# EAGLE design BAROMETRO (EAGLE 9.5.1)
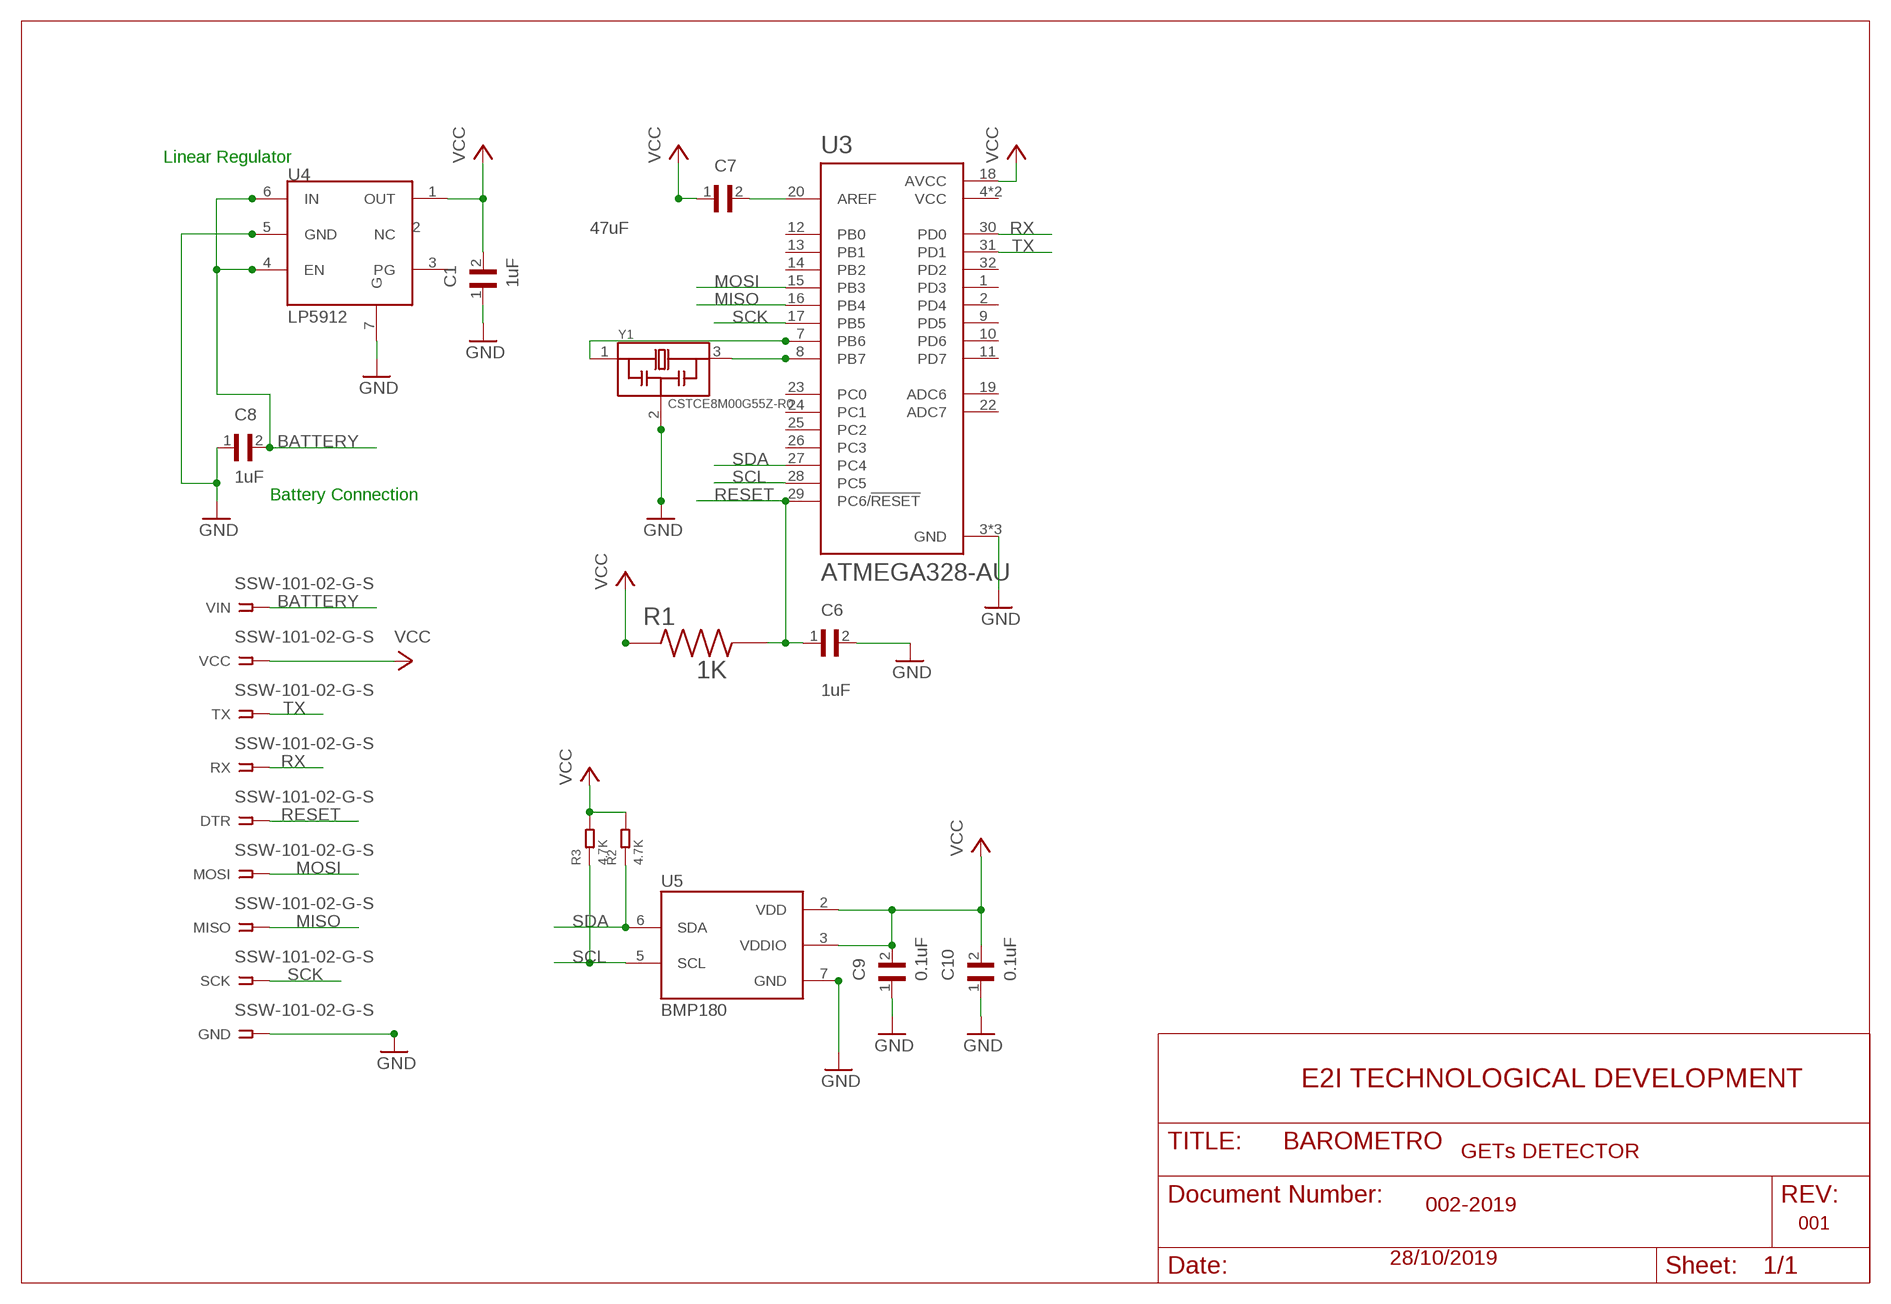
[diagram p0: schematic, sheet 1]

## Parts
C1  1uF  0402YD105MAT2A  [CAPC1005X71N]
C6  1uF  C1206C104K5RAC7025  [CAPC3216X88N]
C7  47uF  GRM32ED70J476ME20L  [CAPC3225X270N]
C8  1uF  0402YD105MAT2A  [CAPC1005X71N]
C9  0.1uF  C0805C104K1RECAUTO  [CAPC2012X110N]
C10  0.1uF  C0805C104K1RECAUTO  [CAPC2012X110N]
DTR  SSW-101-02-G-S  [SSW-101-02-G-S]
GND  SSW-101-02-G-S  [SSW-101-02-G-S]
MISO  SSW-101-02-G-S  [SSW-101-02-G-S]
MOSI  SSW-101-02-G-S  [SSW-101-02-G-S]
R1  1K  RNCS0805BKE1K00  [RESC2012X65N]
R2  4.7K  SMD-RES-4.7K-5%-1/16W(0402)  [R0402]
R3  4.7K  SMD-RES-4.7K-5%-1/16W(0402)  [R0402]
RX  SSW-101-02-G-S  [SSW-101-02-G-S]
SCK  SSW-101-02-G-S  [SSW-101-02-G-S]
TX  SSW-101-02-G-S  [SSW-101-02-G-S]
U3  ATMEGA328-AU  [QFP80P900X900X120-32N]
U4  LP5912  [LP5912]
U5  BMP180  [BMP180]
VCC  SSW-101-02-G-S  [SSW-101-02-G-S]
VIN  SSW-101-02-G-S  [SSW-101-02-G-S]
Y1  CSTCE8M00G55Z-R0  CSTCE16M0V53-R0  [OSC_CSTCE16M0V53-R0]

## Nets
BATTERY: C8.2 U4.4(EN) U4.6(IN) VIN.1
GND: C1.1 C6.2 C8.1 C9.1 C10.1 GND.1 U3.3(GND) U3.5(GND) U3.21(GND) U4.5(GND) U4.7(G) U5.7(GND) Y1.2
MISO: MISO.1 U3.16(PB4)
MOSI: MOSI.1 U3.15(PB3)
N$1: U3.7(PB6) Y1.1
N$2: U3.8(PB7) Y1.3
N$11: C7.2 U3.20(AREF)
RESET: C6.1 DTR.1 R1.2 U3.29(PC6/!RESET)
RX: RX.1 U3.30(PD0)
SCK: SCK.1 U3.17(PB5)
SCL: R3.1 U3.28(PC5) U5.5(SCL)
SDA: R2.1 U3.27(PC4) U5.6(SDA)
TX: TX.1 U3.31(PD1)
VCC: C1.2 C7.1 C9.2 C10.2 R1.1 R2.2 R3.2 U3.18(AVCC) U4.1(OUT) U5.2(VDD) U5.3(VDDIO) VCC.1
Unconnected: U3.1(PD3) U3.2(PD4) U3.9(PD5) U3.10(PD6) U3.11(PD7) U3.12(PB0) U3.13(PB1) U3.14(PB2) U3.19(ADC6) U3.22(ADC7) U3.23(PC0) U3.24(PC1) U3.25(PC2) U3.26(PC3) U3.32(PD2) U4.2(NC) U4.3(PG)

## Notes on the sheet
- Linear Regulator
- Battery Connection
- E2I TECHNOLOGICAL DEVELOPMENT
- GETs DETECTOR
- 002-2019
- 001
- 28/10/2019

## Power pins joined to a net without a drawn wire
VCC: U3.4(VCC) U3.6(VCC)

## Library data of the parts
C1 C8 = Capacitor1uF:0402YD105MAT2A: CAP 1UF 16VDC X5R 20% SMD 0402; AVAILABILITY: Unavailable; DESCRIPTION: Cap 1uf 16vdc X5r 20% Smd 0402; MF: AVX; MP: 0402YD105MAT2A; PACKAGE: 1005 AVX; PRICE: None
C6 = Cap Ceramic 0.1uF smd:C1206C104K5RAC7025; AVAILABILITY: Unavailable; DESCRIPTION: Cap Ceramic 0.1uF 50V X7R 10% SMD 1206 125C Plastic T/R; MF: KEMET; MP: C1206C104K5RAC7025; PACKAGE: 3216 KEMET; PRICE: None
C7 = capacitor 47uF smd:GRM32ED70J476ME20L: CAP 47UF 6.3VDC X7T 20% SMD 1210 EMBOSSED TAPE; AVAILABILITY: Unavailable; DESCRIPTION: Cap 47uf 6.3vdc X7t 20% Smd 1210 Embossed Tape; MF: Murata; MP: GRM32ED70J476ME20L; PACKAGE: 1210 Murata; PRICE: None
C9 C10 = Capacitor smd 104K1-RECAUTO:C0805C104K1RECAUTO: Cap Ceramic 0.1uF 100V X7R 10% Pad SMD 0805 125C T/R; AVAILABILITY: Unavailable; DESCRIPTION: Capacitor: ceramic; MLCC; 100nF; 100V; X7R; ±10%; SMD; 0805; MF: KEMET; MP: C0805C104K1RECAUTO; PACKAGE: 2012 KEMET; PRICE: None
DTR GND MISO MOSI RX SCK TX VCC VIN = con-samtec:SSW-101-02-G-S: THROUGH-HOLE .025" SQ POST SOCKET Source: Samtec SSW.pdf; MF: Samtec Inc.; MPN: SSW-101-02-G-S; OC_FARNELL: unknown; OC_NEWARK: 11P9336
R1 = smd1kresistor:RNCS0805BKE1K00; AVAILABILITY: Unavailable; DESCRIPTION: Res Thin Film 0805 1K Ohm 0.1% 0.1W_1/10W_ ±25ppm/C Pad SMD T/R; MF: Stackpole Electronics Inc; MP: RNCS0805BKE1K00; PACKAGE: 2012 Stackpole; PRICE: None
R2 R3 = RES-4.7K-SMD-5_-1_16W_0402_:SMD-RES-4.7K-5%-1/16W(0402): 301010010; AVAILABILITY: Unavailable; DESCRIPTION: Res Thick Film 0402 4.7K Ohm 5% 0.063W_1/16W_ ?100ppm/C Molded SMD Paper T/R; MF: Yageo; MP: RC0402JR074K7L; PACKAGE: 0402 Yageo; PRICE: None
U3 = ATMEGA328-AU:ATMEGA328-AU: ATmega Series 20 MHz 32 KB Flash 2 KB SRAM 8-Bit Microcontroller - TQFP-32; AVAILABILITY: Unavailable; DESCRIPTION: ATmega Series 20 MHz 32 KB Flash 2 KB SRAM 8-Bit Microcontroller - TQFP-32; MF: Microchip; MP: ATMEGA328-AU; PACKAGE: TQFP-32 Microchip; PRICE: None
U4 = electronic-labs:LP5912
U5 = BMP180:BMP180: BOSCH BMP180 DIGITAL BAROMETRIC PRESSURE SENSOR Web page: http://www.bosch-sensortec.com/en/homepage/products_3/environmental_sensors_1/bmp180_1/bmp180 Datasheet: http://ae-bst.resource.bosch.com/media/products/dokumente/bmp180/BST-BMP180-DS000-09.pdf The BMP180 is the function compatible successor of the BMP085, a new generation of high precision digital pressure sensors for consumer applications. The ultra-low power, low voltage electronics of the BMP180 is optimized for use in mobile phones, PDAs, GPS navigation devices and outdoor equipment. With a low altitude noise of merely 0.25m at fast conversion time, the BMP180 offers superior performance. The I2C interface allows for easy system integration with a microcontroller. The BMP180 is based on piezo-resistive technology for EMC robustness, high accuracy and linearity as well as long term stability. Key features: - Temperature measurement included - I2C interface - Fully calibrated - Pb-free, halogen-free and RoHS compliant, - MSL 1 Basic specs: Pressure range: 300 to 1100hPa (+9000m to -500m relating to sea level) Supply voltage: 1.8 to 3.6V (VDD), 1.62V to 3.6V (VDDIO) Package: LGA package with metal lid Small footprint: 3.6mm x 3.8mm Super-flat: 0.93mm height Low power: 5μA at 1 sample / sec. in standard mode Low noise: 0.06hPa (0.5m) in ultra low power mode, 0.02hPa (0.17m) advanced resolution mode Typical applications: - Enhancement of GPS navigation (dead-reckoning, slope detection, etc.) - In- and out-door navigation - Leisure and sports - Weather forecast - Vertical velocity indication (rise/sink speed); AVAILABILITY: Unavailable; DESCRIPTION: Sensor Pressure Abs; MF: Bosch Sensortec; MP: BMP180; PACKAGE: VLGA-7 Bosch Sensortec; PRICE: None
Y1 = CSTCE16M0V53-R0:CSTCE16M0V53-R0: 16MHz Ceramic Resonator Built in Capacitor 15pF ±0.3% -20°C ~ 80°C Surface Mount; AVAILABILITY: Unavailable; DESCRIPTION: Ceramic Resonator 16MHz ??0.5% _Tol_ ??0.3% _Stability_ 15pF 40Ohm 3-Pin CSMD T/R; MF: Murata; MP: CSTCE16M0V53-R0; PACKAGE: SMD-3 Murata; PRICE: None

## Board
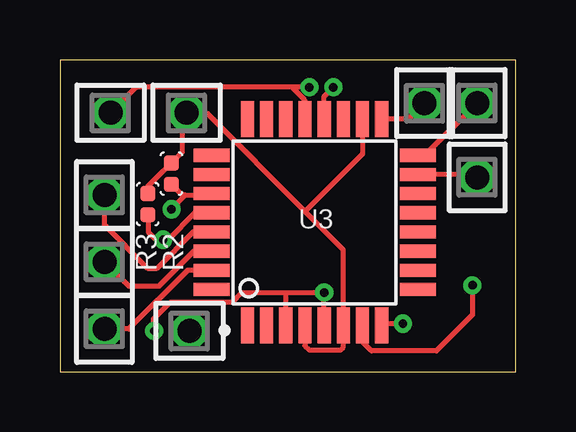
[diagram p1: board, top side]
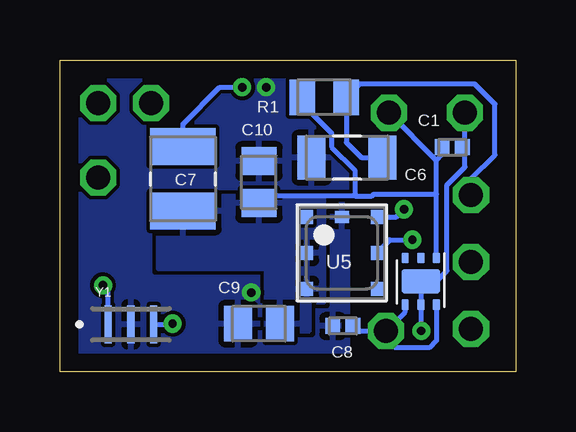
[diagram p2: board, bottom side, seen from below]

Size 19 x 13 mm. Coordinates in mm from the lower left corner, seen from the top.
Outline: 19,0 19,13 0,13 0,0 19,0
Copper layers (1*16): Top 0.035mm / dielectric 1.5mm / Bottom 0.035mm
Design rules "default *": minimum track width 6mil, minimum drill 0.35mm, track to track 6mil, track to pad 6mil, pad to pad 6mil, via to via 6mil, smd to smd 6mil, copper to edge 30mil, drill to drill 6mil, minimum pad ring 10mil, minimum via ring 8mil, stop-mask expansion 4mil, vias tented up to drill 0.5mm, thermal gap 10mil

### Footprints (pad centres in the part's own frame; a part is rotated, then mirrored left to right if it is on the bottom)
CAPC1005X71N = smd 0.62 x 0.67: 1 -0.425,0; 2 0.425,0
CAPC3216X88N = smd 1.16 x 1.82: 1 -1.475,0; 2 1.475,0
CAPC3225X270N = smd 1.53 x 2.72: 1 -1.341,0; 2 1.341,0
CAPC2012X110N = smd 1.16 x 1.47: 1 -0.875,0; 2 0.875,0
SSW-101-02-G-S = drill 1 pad 1.5 octagon: 1 0,0
RESC2012X65N = smd 1.06 x 1.47: 1 -0.925,0; 2 0.925,0
R0402 = smd 0.635 x 0.635: 1 0,0.445; 2 0,-0.445
QFP80P900X900X120-32N = smd 1.5 x 0.55: 1 -4.3,2.8; 2 -4.3,2; 3 -4.3,1.2; 4 -4.3,0.4; 5 -4.3,-0.4; 6 -4.3,-1.2; 7 -4.3,-2; 8 -4.3,-2.8; 17 4.3,-2.8; 18 4.3,-2; 19 4.3,-1.2; 20 4.3,-0.4; 21 4.3,0.4; 22 4.3,1.2; 23 4.3,2; 24 4.3,2.8 | smd 0.55 x 1.5: 9 -2.8,-4.3; 10 -2,-4.3; 11 -1.2,-4.3; 12 -0.4,-4.3; 13 0.4,-4.3; 14 1.2,-4.3; 15 2,-4.3; 16 2.8,-4.3; 25 2.8,4.3; 26 2,4.3; 27 1.2,4.3; 28 0.4,4.3; 29 -0.4,4.3; 30 -1.2,4.3; 31 -2,4.3; 32 -2.8,4.3
LP5912 = smd 0.45 x 0.3: 1 0,0.65; 2 0,0; 3 0,-0.65; 4 1.95,-0.65; 5 1.95,0; 6 1.95,0.65 | smd 1 x 1.6: 7 0.975,0
BMP180 = smd 0.6 x 0.5: 1 1.5,1.45; 2 0,1.45; 3 -1.5,1.45; 4 -1.5,-1.45; 5 0,-1.45; 6 1.5,-1.45 | smd 0.5 x 0.6: 7 1.5,0
OSC_CSTCE16M0V53-R0 = smd 0.3 x 1.6: 1 -0.95,0; 2 0,0; 3 0.95,0

### Placement (x,y rotation side)
C1  2.64,9.36 180 bottom
C6  7.03,8.93 180 bottom
C7  13.87,8.04 90 bottom
C8  7.2,1.9 0 bottom
C9  10.7,2 0 bottom
C10  10.7,7.9 270 bottom
DTR  1.85,7.37 90 top
GND  2.11,10.79 180 top
MISO  17.4,11.2 90 top
MOSI  17.4,8.1 90 top
R1  7.98,11.44 0 bottom
R2  4.65,8.26 180 top
R3  3.66,6.98 180 top
RX  1.85,4.57 90 top
SCK  15.2,11.2 270 top
TX  1.85,1.78 90 top
U3  10.62,6.22 90 top
U4  3.95,4.74 270 bottom
U5  7.24,4.95 90 bottom
VCC  5.28,10.79 180 top
VIN  5.4,1.7 180 top
Y1  16.04,1.97 0 bottom

### Tracks (layer width: path | path; a pad name or v marks a point on that pad's centre or on a via)
BATTERY
  Bottom 0.2: C8.2 6.57,1.7 VIN.1 | VIN.1 4.6,2.5 U4.4 | U4.6 3.3,1.3 3.6,1 5,1 5.4,1.4 VIN.1
GND  (via drill 0.35)
  Top 0.2: GND.1 3.2,11.88 9.66,11.88 | U3.21 10.22,11.32 9.66,11.88 | U3.5 v11.02,3.3 9.4,3.3 | 9.66,11.88 10.38,11.88 v10.4,11.86 | v3.93,1.7 3.9,1.73 3.9,2.2 4.6,2.9 7.2,2.9 7.6,3.3 9.4,3.3 | U3.3 9.42,3.28 9.4,3.3
  Bottom 0.2: 2.11,9.3 2.11,8.54 2.86,7.78 2.86,4.2 3.3,3.77 U4.7 U4.5 3.95,1.72 v3.93,1.7 | 2.11,9.3 GND.1 | C1.1 2.15,9.3 2.11,9.3
  pour Bottom (rank 6): 7,0.1 7,12.8 18.8,12.8 18.8,0.1
MISO
  Top 0.2: U3.16 15.22,9.02 MISO.1
MOSI
  Top 0.2: MOSI.1 17.28,8.22 U3.15
N$1  (via drill 0.35)
  Top 0.2: U3.7 12.6,1.91 12.6,1.26 13,0.86 15.7,0.86 17.2,2.36 v17.2,3.6
  Bottom 0.2: Y1.1 16.99,3.39 v17.2,3.6
N$2  (via drill 0.35)
  Top 0.2: v14.3,2 13.5,2 U3.8
  Bottom 0.2: Y1.3 14.33,1.97 v14.3,2
N$11  (via drill 0.35)
  Top 0.2: U3.20 11.02,11.48 v11.4,11.86
  Bottom 0.2: v11.4,11.86 12.34,11.86 13.87,10.33 C7.2
RESET
  Top 0.2: U3.29 5.56,5.82 4.02,4.29 3.68,4.29 1.85,6.11 DTR.1
  Bottom 0.2: DTR.1 1.85,8.04 0.86,9.04 0.86,11.16 1.7,12 6.49,12 R1.2 7.05,9.55 6.43,8.93 C6.1
RX
  Top 0.2: U3.30 5.59,5.02 4.14,3.57 2.85,3.57 RX.1
SCK
  Top 0.2: SCK.1 14.52,10.52 U3.17
SCL  (via drill 0.35)
  Top 0.2: U3.28 5.62,6.62 4.5,5.5 v4.3,5.5 4,5.5 3.7,5.8 3.7,6.5 R3.1
  Bottom 0.2: U5.5 5.24,5.5 v4.3,5.5
SDA  (via drill 0.35)
  Top 0.2: v4.65,6.77 5.24,7.36 | 5.24,7.36 6.25,7.36 U3.27 | 5.24,7.36 5.1,7.36 R2.1
  Bottom 0.2: U5.6 4.97,6.45 v4.65,6.77
TX
  Top 0.2: U3.31 5.32,4.22 2.87,1.78 TX.1
VCC
  Top 0.2: R3.2 3.66,7.72 4.32,8.38 4.33,8.38 R2.2 5.1,9.15 5.1,10.61 VCC.1 6.11,10.79 10.22,6.68 | U3.18 12.62,9.08 10.22,6.68 | U3.4 10.22,1.08 10.4,0.9 11.7,0.9 11.82,1.02 U3.6 11.82,5.08 10.22,6.68
  Bottom 0.2: R1.1 8.9,11.18 7.67,9.95 7.67,9.37 6.7,8.4 6.7,7.32 | 6.7,7.32 10.4,7.32 C10.2 | U4.1 3.3,7.4 | 3.3,7.4 3.3,8.81 | VCC.1 3.3,8.81 | 3.3,8.81 3.06,9.05 C1.2 | 6.7,7.32 5.99,7.32 5.91,7.4 3.3,7.4 | 3.3,7.4
  pour Bottom (rank 3): 8,2.9 8,7.3 14.9,7.3 14.9,4.3 10.4,4.3 10.4,1.7 8.6,1.7 8.6,2.9